# Altium schematic sheet SupplyBox_v3.SchDoc
size C; SheetNumber: 1; SheetTotal: 1
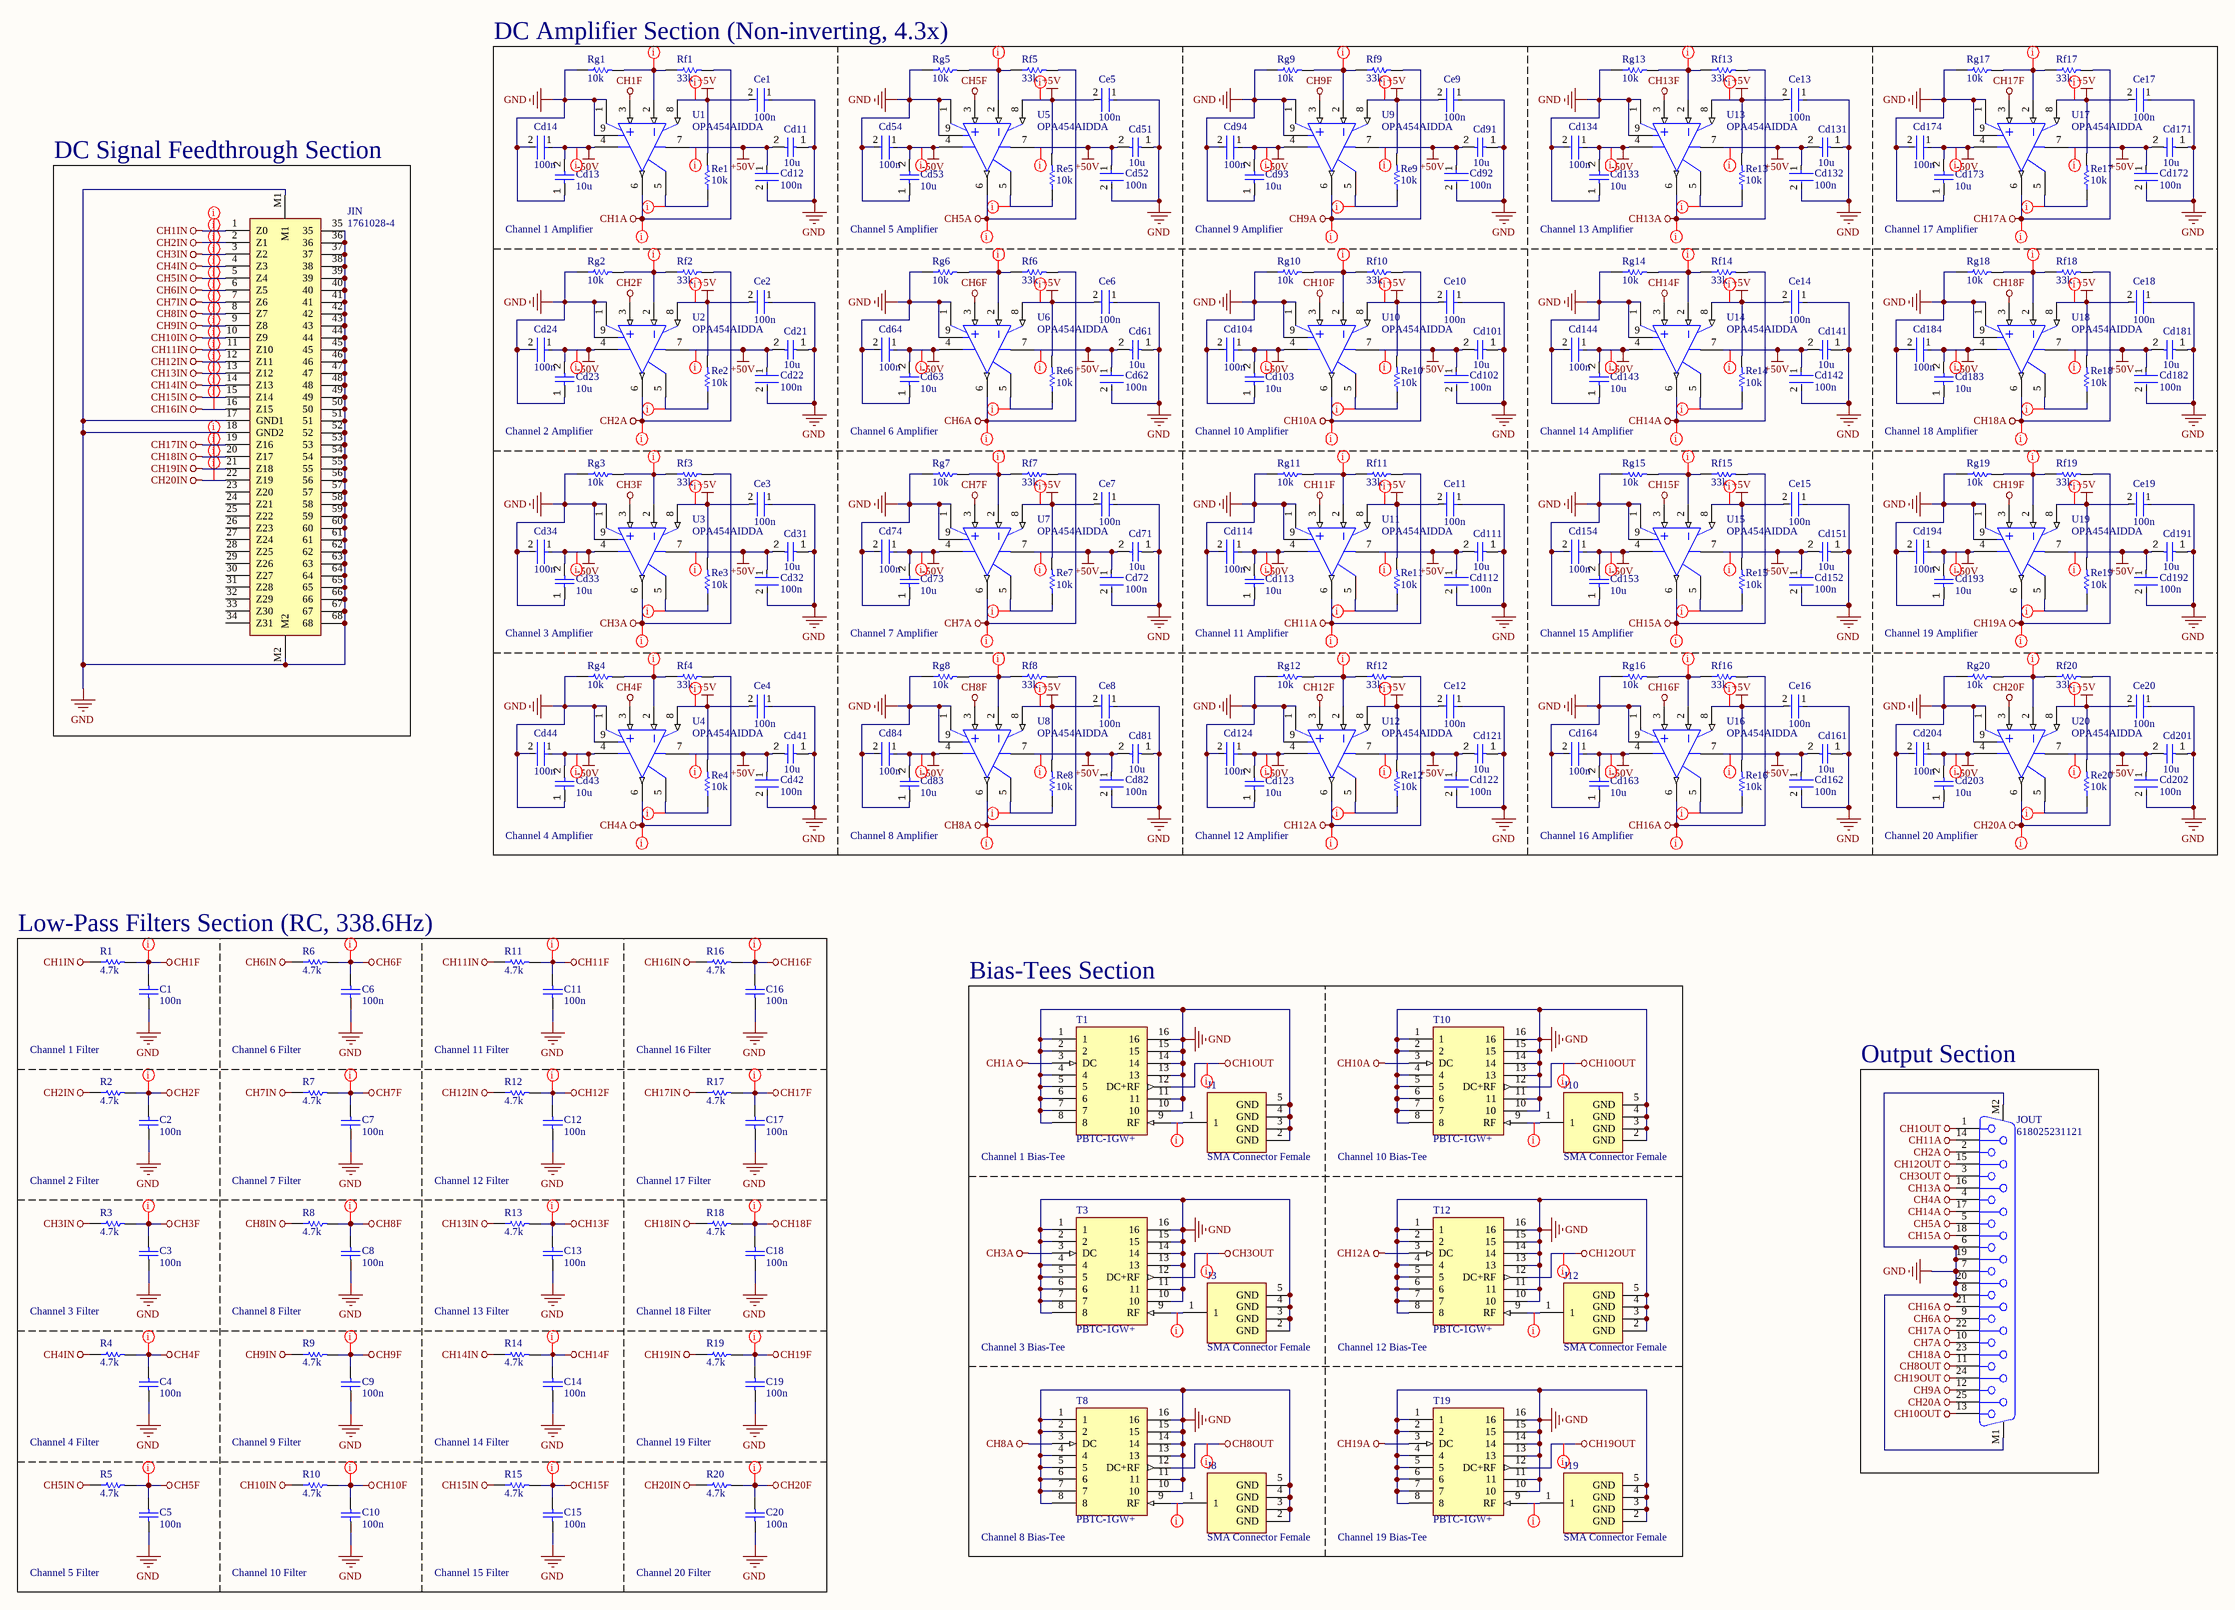
[diagram p0: SupplyBox_v3.SchDoc]

## Parts
C1  100n  [CAPC2013X145X48NL20T23]
C2  100n  [CAPC2013X145X48NL20T23]
C3  100n  [CAPC2013X145X48NL20T23]
C4  100n  [CAPC2013X145X48NL20T23]
C5  100n  [CAPC2013X145X48NL20T23]
C6  100n  [CAPC2013X145X48NL20T23]
C7  100n  [CAPC2013X145X48NL20T23]
C8  100n  [CAPC2013X145X48NL20T23]
C9  100n  [CAPC2013X145X48NL20T23]
C10  100n  [CAPC2013X145X48NL20T23]
C11  100n  [CAPC2013X145X48NL20T23]
C12  100n  [CAPC2013X145X48NL20T23]
C13  100n  [CAPC2013X145X48NL20T23]
C14  100n  [CAPC2013X145X48NL20T23]
C15  100n  [CAPC2013X145X48NL20T23]
C16  100n  [CAPC2013X145X48NL20T23]
C17  100n  [CAPC2013X145X48NL20T23]
C18  100n  [CAPC2013X145X48NL20T23]
C19  100n  [CAPC2013X145X48NL20T23]
C20  100n  [CAPC2013X145X48NL20T23]
Cd11  10u  [RAHV1100M1UCC8002E-Footprint-1]
Cd12  100n  [FP-CC0805-0_85-MFG]
Cd13  10u  [RAHV1100M1UCC8002E-Footprint-1]
Cd14  100n  [FP-CC0805-0_85-MFG]
Cd21  10u  [RAHV1100M1UCC8002E-Footprint-1]
Cd22  100n  [FP-CC0805-0_85-MFG]
Cd23  10u  [RAHV1100M1UCC8002E-Footprint-1]
Cd24  100n  [FP-CC0805-0_85-MFG]
Cd31  10u  [RAHV1100M1UCC8002E-Footprint-1]
Cd32  100n  [FP-CC0805-0_85-MFG]
Cd33  10u  [RAHV1100M1UCC8002E-Footprint-1]
Cd34  100n  [FP-CC0805-0_85-MFG]
Cd41  10u  [RAHV1100M1UCC8002E-Footprint-1]
Cd42  100n  [FP-CC0805-0_85-MFG]
Cd43  10u  [RAHV1100M1UCC8002E-Footprint-1]
Cd44  100n  [FP-CC0805-0_85-MFG]
Cd51  10u  [RAHV1100M1UCC8002E-Footprint-1]
Cd52  100n  [FP-CC0805-0_85-MFG]
Cd53  10u  [RAHV1100M1UCC8002E-Footprint-1]
Cd54  100n  [FP-CC0805-0_85-MFG]
Cd61  10u  [RAHV1100M1UCC8002E-Footprint-1]
Cd62  100n  [FP-CC0805-0_85-MFG]
Cd63  10u  [RAHV1100M1UCC8002E-Footprint-1]
Cd64  100n  [FP-CC0805-0_85-MFG]
Cd71  10u  [RAHV1100M1UCC8002E-Footprint-1]
Cd72  100n  [FP-CC0805-0_85-MFG]
Cd73  10u  [RAHV1100M1UCC8002E-Footprint-1]
Cd74  100n  [FP-CC0805-0_85-MFG]
Cd81  10u  [RAHV1100M1UCC8002E-Footprint-1]
Cd82  100n  [FP-CC0805-0_85-MFG]
Cd83  10u  [RAHV1100M1UCC8002E-Footprint-1]
Cd84  100n  [FP-CC0805-0_85-MFG]
Cd91  10u  [RAHV1100M1UCC8002E-Footprint-1]
Cd92  100n  [FP-CC0805-0_85-MFG]
Cd93  10u  [RAHV1100M1UCC8002E-Footprint-1]
Cd94  100n  [FP-CC0805-0_85-MFG]
Cd101  10u  [RAHV1100M1UCC8002E-Footprint-1]
Cd102  100n  [FP-CC0805-0_85-MFG]
Cd103  10u  [RAHV1100M1UCC8002E-Footprint-1]
Cd104  100n  [FP-CC0805-0_85-MFG]
Cd111  10u  [RAHV1100M1UCC8002E-Footprint-1]
Cd112  100n  [FP-CC0805-0_85-MFG]
Cd113  10u  [RAHV1100M1UCC8002E-Footprint-1]
Cd114  100n  [FP-CC0805-0_85-MFG]
Cd121  10u  [RAHV1100M1UCC8002E-Footprint-1]
Cd122  100n  [FP-CC0805-0_85-MFG]
Cd123  10u  [RAHV1100M1UCC8002E-Footprint-1]
Cd124  100n  [FP-CC0805-0_85-MFG]
Cd131  10u  [RAHV1100M1UCC8002E-Footprint-1]
Cd132  100n  [FP-CC0805-0_85-MFG]
Cd133  10u  [RAHV1100M1UCC8002E-Footprint-1]
Cd134  100n  [FP-CC0805-0_85-MFG]
Cd141  10u  [RAHV1100M1UCC8002E-Footprint-1]
Cd142  100n  [FP-CC0805-0_85-MFG]
Cd143  10u  [RAHV1100M1UCC8002E-Footprint-1]
Cd144  100n  [FP-CC0805-0_85-MFG]
Cd151  10u  [RAHV1100M1UCC8002E-Footprint-1]
Cd152  100n  [FP-CC0805-0_85-MFG]
Cd153  10u  [RAHV1100M1UCC8002E-Footprint-1]
Cd154  100n  [FP-CC0805-0_85-MFG]
Cd161  10u  [RAHV1100M1UCC8002E-Footprint-1]
Cd162  100n  [FP-CC0805-0_85-MFG]
Cd163  10u  [RAHV1100M1UCC8002E-Footprint-1]
Cd164  100n  [FP-CC0805-0_85-MFG]
Cd171  10u  [RAHV1100M1UCC8002E-Footprint-1]
Cd172  100n  [FP-CC0805-0_85-MFG]
Cd173  10u  [RAHV1100M1UCC8002E-Footprint-1]
Cd174  100n  [FP-CC0805-0_85-MFG]
Cd181  10u  [RAHV1100M1UCC8002E-Footprint-1]
Cd182  100n  [FP-CC0805-0_85-MFG]
Cd183  10u  [RAHV1100M1UCC8002E-Footprint-1]
Cd184  100n  [FP-CC0805-0_85-MFG]
Cd191  10u  [RAHV1100M1UCC8002E-Footprint-1]
Cd192  100n  [FP-CC0805-0_85-MFG]
Cd193  10u  [RAHV1100M1UCC8002E-Footprint-1]
Cd194  100n  [FP-CC0805-0_85-MFG]
Cd201  10u  [RAHV1100M1UCC8002E-Footprint-1]
Cd202  100n  [FP-CC0805-0_85-MFG]
Cd203  10u  [RAHV1100M1UCC8002E-Footprint-1]
Cd204  100n  [FP-CC0805-0_85-MFG]
Ce1  100n  [FP-CC0805-0_85-MFG]
Ce2  100n  [FP-CC0805-0_85-MFG]
Ce3  100n  [FP-CC0805-0_85-MFG]
Ce4  100n  [FP-CC0805-0_85-MFG]
Ce5  100n  [FP-CC0805-0_85-MFG]
Ce6  100n  [FP-CC0805-0_85-MFG]
Ce7  100n  [FP-CC0805-0_85-MFG]
Ce8  100n  [FP-CC0805-0_85-MFG]
Ce9  100n  [FP-CC0805-0_85-MFG]
Ce10  100n  [FP-CC0805-0_85-MFG]
Ce11  100n  [FP-CC0805-0_85-MFG]
Ce12  100n  [FP-CC0805-0_85-MFG]
Ce13  100n  [FP-CC0805-0_85-MFG]
Ce14  100n  [FP-CC0805-0_85-MFG]
Ce15  100n  [FP-CC0805-0_85-MFG]
Ce16  100n  [FP-CC0805-0_85-MFG]
Ce17  100n  [FP-CC0805-0_85-MFG]
Ce18  100n  [FP-CC0805-0_85-MFG]
Ce19  100n  [FP-CC0805-0_85-MFG]
Ce20  100n  [FP-CC0805-0_85-MFG]
J1  SMA Connector Female  [SMA_Smaller]
J3  SMA Connector Female  [SMA_Smaller]
J8  SMA Connector Female  [SMA_Smaller]
J10  SMA Connector Female  [SMA_Smaller]
J12  SMA Connector Female  [SMA_Smaller]
J19  SMA Connector Female  [SMA_Smaller]
JIN  1761028-4  [1761028-4-Footprint-1]
JOUT  618025231121  [618025231121]
R1  4.7k  [RESC2013X60X35NL10T20]
R2  4.7k  [RESC2013X60X35NL10T20]
R3  4.7k  [RESC2013X60X35NL10T20]
R4  4.7k  [RESC2013X60X35NL10T20]
R5  4.7k  [RESC2013X60X35NL10T20]
R6  4.7k  [RESC2013X60X35NL10T20]
R7  4.7k  [RESC2013X60X35NL10T20]
R8  4.7k  [RESC2013X60X35NL10T20]
R9  4.7k  [RESC2013X60X35NL10T20]
R10  4.7k  [RESC2013X60X35NL10T20]
R11  4.7k  [RESC2013X60X35NL10T20]
R12  4.7k  [RESC2013X60X35NL10T20]
R13  4.7k  [RESC2013X60X35NL10T20]
R14  4.7k  [RESC2013X60X35NL10T20]
R15  4.7k  [RESC2013X60X35NL10T20]
R16  4.7k  [RESC2013X60X35NL10T20]
R17  4.7k  [RESC2013X60X35NL10T20]
R18  4.7k  [RESC2013X60X35NL10T20]
R19  4.7k  [RESC2013X60X35NL10T20]
R20  4.7k  [RESC2013X60X35NL10T20]
Re1  10k  [RESC2013X60X35ML10T20]
Re2  10k  [RESC2013X60X35ML10T20]
Re3  10k  [RESC2013X60X35ML10T20]
Re4  10k  [RESC2013X60X35ML10T20]
Re5  10k  [RESC2013X60X35ML10T20]
Re6  10k  [RESC2013X60X35ML10T20]
Re7  10k  [RESC2013X60X35ML10T20]
Re8  10k  [RESC2013X60X35ML10T20]
Re9  10k  [RESC2013X60X35ML10T20]
Re10  10k  [RESC2013X60X35ML10T20]
Re11  10k  [RESC2013X60X35ML10T20]
Re12  10k  [RESC2013X60X35ML10T20]
Re13  10k  [RESC2013X60X35ML10T20]
Re14  10k  [RESC2013X60X35ML10T20]
Re15  10k  [RESC2013X60X35ML10T20]
Re16  10k  [RESC2013X60X35ML10T20]
Re17  10k  [RESC2013X60X35ML10T20]
Re18  10k  [RESC2013X60X35ML10T20]
Re19  10k  [RESC2013X60X35ML10T20]
Re20  10k  [RESC2013X60X35ML10T20]
Rf1  33k  [RESC2013X60X35ML10T20]
Rf2  33k  [RESC2013X60X35ML10T20]
Rf3  33k  [RESC2013X60X35ML10T20]
Rf4  33k  [RESC2013X60X35ML10T20]
Rf5  33k  [RESC2013X60X35ML10T20]
Rf6  33k  [RESC2013X60X35ML10T20]
Rf7  33k  [RESC2013X60X35ML10T20]
Rf8  33k  [RESC2013X60X35ML10T20]
Rf9  33k  [RESC2013X60X35ML10T20]
Rf10  33k  [RESC2013X60X35ML10T20]
Rf11  33k  [RESC2013X60X35ML10T20]
Rf12  33k  [RESC2013X60X35ML10T20]
Rf13  33k  [RESC2013X60X35ML10T20]
Rf14  33k  [RESC2013X60X35ML10T20]
Rf15  33k  [RESC2013X60X35ML10T20]
Rf16  33k  [RESC2013X60X35ML10T20]
Rf17  33k  [RESC2013X60X35ML10T20]
Rf18  33k  [RESC2013X60X35ML10T20]
Rf19  33k  [RESC2013X60X35ML10T20]
Rf20  33k  [RESC2013X60X35ML10T20]
Rg1  10k  [RESC2013X60X35ML10T20]
Rg2  10k  [RESC2013X60X35ML10T20]
Rg3  10k  [RESC2013X60X35ML10T20]
Rg4  10k  [RESC2013X60X35ML10T20]
Rg5  10k  [RESC2013X60X35ML10T20]
Rg6  10k  [RESC2013X60X35ML10T20]
Rg7  10k  [RESC2013X60X35ML10T20]
Rg8  10k  [RESC2013X60X35ML10T20]
Rg9  10k  [RESC2013X60X35ML10T20]
Rg10  10k  [RESC2013X60X35ML10T20]
Rg11  10k  [RESC2013X60X35ML10T20]
Rg12  10k  [RESC2013X60X35ML10T20]
Rg13  10k  [RESC2013X60X35ML10T20]
Rg14  10k  [RESC2013X60X35ML10T20]
Rg15  10k  [RESC2013X60X35ML10T20]
Rg16  10k  [RESC2013X60X35ML10T20]
Rg17  10k  [RESC2013X60X35ML10T20]
Rg18  10k  [RESC2013X60X35ML10T20]
Rg19  10k  [RESC2013X60X35ML10T20]
Rg20  10k  [RESC2013X60X35ML10T20]
T1  PBTC-1GW+  [PBTC-1GW+]
T3  PBTC-1GW+  [PBTC-1GW+]
T8  PBTC-1GW+  [PBTC-1GW+]
T10  PBTC-1GW+  [PBTC-1GW+]
T12  PBTC-1GW+  [PBTC-1GW+]
T19  PBTC-1GW+  [PBTC-1GW+]
U1  OPA454AIDDA  [DDA0008C_L]
U2  OPA454AIDDA  [DDA0008C_L]
U3  OPA454AIDDA  [DDA0008C_L]
U4  OPA454AIDDA  [DDA0008C_L]
U5  OPA454AIDDA  [DDA0008C_L]
U6  OPA454AIDDA  [DDA0008C_L]
U7  OPA454AIDDA  [DDA0008C_L]
U8  OPA454AIDDA  [DDA0008C_L]
U9  OPA454AIDDA  [DDA0008C_L]
U10  OPA454AIDDA  [DDA0008C_L]
U11  OPA454AIDDA  [DDA0008C_L]
U12  OPA454AIDDA  [DDA0008C_L]
U13  OPA454AIDDA  [DDA0008C_L]
U14  OPA454AIDDA  [DDA0008C_L]
U15  OPA454AIDDA  [DDA0008C_L]
U16  OPA454AIDDA  [DDA0008C_L]
U17  OPA454AIDDA  [DDA0008C_L]
U18  OPA454AIDDA  [DDA0008C_L]
U19  OPA454AIDDA  [DDA0008C_L]
U20  OPA454AIDDA  [DDA0008C_L]

## Blocks framed on the sheet
DC Amplifier Section (Non-inverting, 4.3x): Cd11-Cd14 Cd21-Cd24 Cd31-Cd34 Cd41-Cd44 Cd51-Cd54 Cd61-Cd64 Cd71-Cd74 Cd81-Cd84 Cd91-Cd94 Cd101-Cd104 Cd111-Cd114 Cd121-Cd124 Cd131-Cd134 Cd141-Cd144 Cd151-Cd154 Cd161-Cd164 Cd171-Cd174 Cd181-Cd184 Cd191-Cd194 Cd201-Cd204 Ce1-Ce20 Re1-Re20 Rf1-Rf20 Rg1-Rg20 U1-U20
DC Signal Feedthrough Section: JIN
Low-Pass Filters Section (RC, 338.6Hz): C1-C20 R1-R20
Bias-Tees Section: J1 J3 J8 J10 J12 J19 T1 T3 T8 T10 T12 T19
Output Section: JOUT

## Nets
+5V: Ce1.2 Ce2.2 Ce3.2 Ce4.2 Ce5.2 Ce6.2 Ce7.2 Ce8.2 Ce9.2 Ce10.2 Ce11.2 Ce12.2 Ce13.2 Ce14.2 Ce15.2 Ce16.2 Ce17.2 Ce18.2 Ce19.2 Ce20.2 Re1.2 Re2.2 Re3.2 Re4.2 Re5.2 Re6.2 Re7.2 Re8.2 Re9.2 Re10.2 Re11.2 Re12.2 Re13.2 Re14.2 Re15.2 Re16.2 Re17.2 Re18.2 Re19.2 Re20.2 U1.8(E/D) U2.8(E/D) U3.8(E/D) U4.8(E/D) U5.8(E/D) U6.8(E/D) U7.8(E/D) U8.8(E/D) U9.8(E/D) U10.8(E/D) U11.8(E/D) U12.8(E/D) U13.8(E/D) U14.8(E/D) U15.8(E/D) U16.8(E/D) U17.8(E/D) U18.8(E/D) U19.8(E/D) U20.8(E/D)
+50V: Cd11.2 Cd12.1 Cd21.2 Cd22.1 Cd31.2 Cd32.1 Cd41.2 Cd42.1 Cd51.2 Cd52.1 Cd61.2 Cd62.1 Cd71.2 Cd72.1 Cd81.2 Cd82.1 Cd91.2 Cd92.1 Cd101.2 Cd102.1 Cd111.2 Cd112.1 Cd121.2 Cd122.1 Cd131.2 Cd132.1 Cd141.2 Cd142.1 Cd151.2 Cd152.1 Cd161.2 Cd162.1 Cd171.2 Cd172.1 Cd181.2 Cd182.1 Cd191.2 Cd192.1 Cd201.2 Cd202.1 U1.7(V+) U2.7(V+) U3.7(V+) U4.7(V+) U5.7(V+) U6.7(V+) U7.7(V+) U8.7(V+) U9.7(V+) U10.7(V+) U11.7(V+) U12.7(V+) U13.7(V+) U14.7(V+) U15.7(V+) U16.7(V+) U17.7(V+) U18.7(V+) U19.7(V+) U20.7(V+)
-50V: Cd13.2 Cd14.1 Cd23.2 Cd24.1 Cd33.2 Cd34.1 Cd43.2 Cd44.1 Cd53.2 Cd54.1 Cd63.2 Cd64.1 Cd73.2 Cd74.1 Cd83.2 Cd84.1 Cd93.2 Cd94.1 Cd103.2 Cd104.1 Cd113.2 Cd114.1 Cd123.2 Cd124.1 Cd133.2 Cd134.1 Cd143.2 Cd144.1 Cd153.2 Cd154.1 Cd163.2 Cd164.1 Cd173.2 Cd174.1 Cd183.2 Cd184.1 Cd193.2 Cd194.1 Cd203.2 Cd204.1 U1.4(V-) U2.4(V-) U3.4(V-) U4.4(V-) U5.4(V-) U6.4(V-) U7.4(V-) U8.4(V-) U9.4(V-) U10.4(V-) U11.4(V-) U12.4(V-) U13.4(V-) U14.4(V-) U15.4(V-) U16.4(V-) U17.4(V-) U18.4(V-) U19.4(V-) U20.4(V-)
CH1A: Rf1.2 T1.3(DC) U1.6(OUT)
CH1F: C1.2 R1.2 U1.3(IN+)
CH1IN: JIN.1(Z0) R1.1
CH1OUT: JOUT.1 T1.12(DC+RF)
CH2A: JOUT.2 Rf2.2 U2.6(OUT)
CH2F: C2.2 R2.2 U2.3(IN+)
CH2IN: JIN.2(Z1) R2.1
CH3A: Rf3.2 T3.3(DC) U3.6(OUT)
CH3F: C3.2 R3.2 U3.3(IN+)
CH3IN: JIN.3(Z2) R3.1
CH3OUT: JOUT.3 T3.12(DC+RF)
CH4A: JOUT.4 Rf4.2 U4.6(OUT)
CH4F: C4.2 R4.2 U4.3(IN+)
CH4IN: JIN.4(Z3) R4.1
CH5A: JOUT.5 Rf5.2 U5.6(OUT)
CH5F: C5.2 R5.2 U5.3(IN+)
CH5IN: JIN.5(Z4) R5.1
CH6A: JOUT.9 Rf6.2 U6.6(OUT)
CH6F: C6.2 R6.2 U6.3(IN+)
CH6IN: JIN.6(Z5) R6.1
CH7A: JOUT.10 Rf7.2 U7.6(OUT)
CH7F: C7.2 R7.2 U7.3(IN+)
CH7IN: JIN.7(Z6) R7.1
CH8A: Rf8.2 T8.3(DC) U8.6(OUT)
CH8F: C8.2 R8.2 U8.3(IN+)
CH8IN: JIN.8(Z7) R8.1
CH8OUT: JOUT.11 T8.12(DC+RF)
CH9A: JOUT.12 Rf9.2 U9.6(OUT)
CH9F: C9.2 R9.2 U9.3(IN+)
CH9IN: JIN.9(Z8) R9.1
CH10A: Rf10.2 T10.3(DC) U10.6(OUT)
CH10F: C10.2 R10.2 U10.3(IN+)
CH10IN: JIN.10(Z9) R10.1
CH10OUT: JOUT.13 T10.12(DC+RF)
CH11A: JOUT.14 Rf11.2 U11.6(OUT)
CH11F: C11.2 R11.2 U11.3(IN+)
CH11IN: JIN.11(Z10) R11.1
CH12A: Rf12.2 T12.3(DC) U12.6(OUT)
CH12F: C12.2 R12.2 U12.3(IN+)
CH12IN: JIN.12(Z11) R12.1
CH12OUT: JOUT.15 T12.12(DC+RF)
CH13A: JOUT.16 Rf13.2 U13.6(OUT)
CH13F: C13.2 R13.2 U13.3(IN+)
CH13IN: JIN.13(Z12) R13.1
CH14A: JOUT.17 Rf14.2 U14.6(OUT)
CH14F: C14.2 R14.2 U14.3(IN+)
CH14IN: JIN.14(Z13) R14.1
CH15A: JOUT.18 Rf15.2 U15.6(OUT)
CH15F: C15.2 R15.2 U15.3(IN+)
CH15IN: JIN.15(Z14) R15.1
CH16A: JOUT.21 Rf16.2 U16.6(OUT)
CH16F: C16.2 R16.2 U16.3(IN+)
CH16IN: JIN.16(Z15) R16.1
CH17A: JOUT.22 Rf17.2 U17.6(OUT)
CH17F: C17.2 R17.2 U17.3(IN+)
CH17IN: JIN.19(Z16) R17.1
CH18A: JOUT.23 Rf18.2 U18.6(OUT)
CH18F: C18.2 R18.2 U18.3(IN+)
CH18IN: JIN.20(Z17) R18.1
CH19A: Rf19.2 T19.3(DC) U19.6(OUT)
CH19F: C19.2 R19.2 U19.3(IN+)
CH19IN: JIN.21(Z18) R19.1
CH19OUT: JOUT.24 T19.12(DC+RF)
CH20A: JOUT.25 Rf20.2 U20.6(OUT)
CH20F: C20.2 R20.2 U20.3(IN+)
CH20IN: JIN.22(Z19) R20.1
GND: C1.1 C2.1 C3.1 C4.1 C5.1 C6.1 C7.1 C8.1 C9.1 C10.1 C11.1 C12.1 C13.1 C14.1 C15.1 C16.1 C17.1 C18.1 C19.1 C20.1 Cd11.1 Cd12.2 Cd13.1 Cd14.2 Cd21.1 Cd22.2 Cd23.1 Cd24.2 Cd31.1 Cd32.2 Cd33.1 Cd34.2 Cd41.1 Cd42.2 Cd43.1 Cd44.2 Cd51.1 Cd52.2 Cd53.1 Cd54.2 Cd61.1 Cd62.2 Cd63.1 Cd64.2 Cd71.1 Cd72.2 Cd73.1 Cd74.2 Cd81.1 Cd82.2 Cd83.1 Cd84.2 Cd91.1 Cd92.2 Cd93.1 Cd94.2 Cd101.1 Cd102.2 Cd103.1 Cd104.2 Cd111.1 Cd112.2 Cd113.1 Cd114.2 Cd121.1 Cd122.2 Cd123.1 Cd124.2 Cd131.1 Cd132.2 Cd133.1 Cd134.2 Cd141.1 Cd142.2 Cd143.1 Cd144.2 Cd151.1 Cd152.2 Cd153.1 Cd154.2 Cd161.1 Cd162.2 Cd163.1 Cd164.2 Cd171.1 Cd172.2 Cd173.1 Cd174.2 Cd181.1 Cd182.2 Cd183.1 Cd184.2 Cd191.1 Cd192.2 Cd193.1 Cd194.2 Cd201.1 Cd202.2 Cd203.1 Cd204.2 Ce1.1 Ce2.1 Ce3.1 Ce4.1 Ce5.1 Ce6.1 Ce7.1 Ce8.1 Ce9.1 Ce10.1 Ce11.1 Ce12.1 Ce13.1 Ce14.1 Ce15.1 Ce16.1 Ce17.1 Ce18.1 Ce19.1 Ce20.1 J1.2(GND) J1.3(GND) J1.4(GND) J1.5(GND) J3.2(GND) J3.3(GND) J3.4(GND) J3.5(GND) J8.2(GND) J8.3(GND) J8.4(GND) J8.5(GND) J10.2(GND) J10.3(GND) J10.4(GND) J10.5(GND) J12.2(GND) J12.3(GND) J12.4(GND) J12.5(GND) J19.2(GND) J19.3(GND) J19.4(GND) J19.5(GND) JIN.17(GND1) JIN.18(GND2) JIN.35 JIN.36 JIN.37 JIN.38 JIN.39 JIN.40 JIN.41 JIN.42 JIN.43 JIN.44 JIN.45 JIN.46 JIN.47 JIN.48 JIN.49 JIN.50 JIN.51 JIN.52 JIN.53 JIN.54 JIN.55 JIN.56 JIN.57 JIN.58 JIN.59 JIN.60 JIN.61 JIN.62 JIN.63 JIN.64 JIN.65 JIN.66 JIN.67 JIN.68 JIN.M1 JIN.M2 JOUT.6 JOUT.7 JOUT.8 JOUT.19 JOUT.20 JOUT.M1 JOUT.M2 Rg1.1 Rg2.1 Rg3.1 Rg4.1 Rg5.1 Rg6.1 Rg7.1 Rg8.1 Rg9.1 Rg10.1 Rg11.1 Rg12.1 Rg13.1 Rg14.1 Rg15.1 Rg16.1 Rg17.1 Rg18.1 Rg19.1 Rg20.1 T1.1 T1.2 T1.4 T1.5 T1.6 T1.7 T1.8 T1.10 T1.11 T1.13 T1.14 T1.15 T1.16 T3.1 T3.2 T3.4 T3.5 T3.6 T3.7 T3.8 T3.10 T3.11 T3.13 T3.14 T3.15 T3.16 T8.1 T8.2 T8.4 T8.5 T8.6 T8.7 T8.8 T8.10 T8.11 T8.13 T8.14 T8.15 T8.16 T10.1 T10.2 T10.4 T10.5 T10.6 T10.7 T10.8 T10.10 T10.11 T10.13 T10.14 T10.15 T10.16 T12.1 T12.2 T12.4 T12.5 T12.6 T12.7 T12.8 T12.10 T12.11 T12.13 T12.14 T12.15 T12.16 T19.1 T19.2 T19.4 T19.5 T19.6 T19.7 T19.8 T19.10 T19.11 T19.13 T19.14 T19.15 T19.16 U1.1(E/D_COM) U1.9(EP) U2.1(E/D_COM) U2.9(EP) U3.1(E/D_COM) U3.9(EP) U4.1(E/D_COM) U4.9(EP) U5.1(E/D_COM) U5.9(EP) U6.1(E/D_COM) U6.9(EP) U7.1(E/D_COM) U7.9(EP) U8.1(E/D_COM) U8.9(EP) U9.1(E/D_COM) U9.9(EP) U10.1(E/D_COM) U10.9(EP) U11.1(E/D_COM) U11.9(EP) U12.1(E/D_COM) U12.9(EP) U13.1(E/D_COM) U13.9(EP) U14.1(E/D_COM) U14.9(EP) U15.1(E/D_COM) U15.9(EP) U16.1(E/D_COM) U16.9(EP) U17.1(E/D_COM) U17.9(EP) U18.1(E/D_COM) U18.9(EP) U19.1(E/D_COM) U19.9(EP) U20.1(E/D_COM) U20.9(EP)
NetJ1_1: J1.1 T1.9(RF)
NetJ3_1: J3.1 T3.9(RF)
NetJ8_1: J8.1 T8.9(RF)
NetJ10_1: J10.1 T10.9(RF)
NetJ12_1: J12.1 T12.9(RF)
NetJ19_1: J19.1 T19.9(RF)
NetRe1_1: Re1.1 U1.5(STATUS_FLAG)
NetRe2_1: Re2.1 U2.5(STATUS_FLAG)
NetRe3_1: Re3.1 U3.5(STATUS_FLAG)
NetRe4_1: Re4.1 U4.5(STATUS_FLAG)
NetRe5_1: Re5.1 U5.5(STATUS_FLAG)
NetRe6_1: Re6.1 U6.5(STATUS_FLAG)
NetRe7_1: Re7.1 U7.5(STATUS_FLAG)
NetRe8_1: Re8.1 U8.5(STATUS_FLAG)
NetRe9_1: Re9.1 U9.5(STATUS_FLAG)
NetRe10_1: Re10.1 U10.5(STATUS_FLAG)
NetRe11_1: Re11.1 U11.5(STATUS_FLAG)
NetRe12_1: Re12.1 U12.5(STATUS_FLAG)
NetRe13_1: Re13.1 U13.5(STATUS_FLAG)
NetRe14_1: Re14.1 U14.5(STATUS_FLAG)
NetRe15_1: Re15.1 U15.5(STATUS_FLAG)
NetRe16_1: Re16.1 U16.5(STATUS_FLAG)
NetRe17_1: Re17.1 U17.5(STATUS_FLAG)
NetRe18_1: Re18.1 U18.5(STATUS_FLAG)
NetRe19_1: Re19.1 U19.5(STATUS_FLAG)
NetRe20_1: Re20.1 U20.5(STATUS_FLAG)
NetRf1_1: Rf1.1 Rg1.2 U1.2(IN-)
NetRf2_1: Rf2.1 Rg2.2 U2.2(IN-)
NetRf3_1: Rf3.1 Rg3.2 U3.2(IN-)
NetRf4_1: Rf4.1 Rg4.2 U4.2(IN-)
NetRf5_1: Rf5.1 Rg5.2 U5.2(IN-)
NetRf6_1: Rf6.1 Rg6.2 U6.2(IN-)
NetRf7_1: Rf7.1 Rg7.2 U7.2(IN-)
NetRf8_1: Rf8.1 Rg8.2 U8.2(IN-)
NetRf9_1: Rf9.1 Rg9.2 U9.2(IN-)
NetRf10_1: Rf10.1 Rg10.2 U10.2(IN-)
NetRf11_1: Rf11.1 Rg11.2 U11.2(IN-)
NetRf12_1: Rf12.1 Rg12.2 U12.2(IN-)
NetRf13_1: Rf13.1 Rg13.2 U13.2(IN-)
NetRf14_1: Rf14.1 Rg14.2 U14.2(IN-)
NetRf15_1: Rf15.1 Rg15.2 U15.2(IN-)
NetRf16_1: Rf16.1 Rg16.2 U16.2(IN-)
NetRf17_1: Rf17.1 Rg17.2 U17.2(IN-)
NetRf18_1: Rf18.1 Rg18.2 U18.2(IN-)
NetRf19_1: Rf19.1 Rg19.2 U19.2(IN-)
NetRf20_1: Rf20.1 Rg20.2 U20.2(IN-)

Not connected (* = marked no-connect by the designer): JIN 23(Z20) 24(Z21) 25(Z22) 26(Z23) 27(Z24) 28(Z25) 29(Z26) 30(Z27) 31(Z28) 32(Z29) 33(Z30) 34(Z31)

## Layout directives
net class HV: +50V, -50V, CH1A, CH2A, CH3A, CH4A, CH5A, CH6A, CH7A, CH8A, CH9A, CH10A, CH11A, CH12A, CH13A, CH14A, CH15A, CH16A, CH17A, CH18A, CH19A, CH20A
net class LV: +5V, CH1F, CH1IN, CH2F, CH2IN, CH3F, CH3IN, CH4F, CH4IN, CH5F, CH5IN, CH6F, CH6IN, CH7F, CH7IN, CH8F, CH8IN, CH9F, CH9IN, CH10F, CH10IN, CH11F, CH11IN, CH12F, CH12IN, CH13F, CH13IN, CH14F, CH14IN, CH15F, CH15IN, CH16F, CH16IN, CH17F, CH17IN, CH18F, CH18IN, CH19F, CH19IN, CH20F, CH20IN, NetRe1_1, NetRe2_1, NetRe3_1, NetRe4_1, NetRe5_1, NetRe6_1, NetRe7_1, NetRe8_1, NetRe9_1, NetRe10_1, NetRe11_1, NetRe12_1, NetRe13_1, NetRe14_1, NetRe15_1, NetRe16_1, NetRe17_1, NetRe18_1, NetRe19_1, NetRe20_1, NetRf1_1, NetRf2_1, NetRf3_1, NetRf4_1, NetRf5_1, NetRf6_1, NetRf7_1, NetRf8_1, NetRf9_1, NetRf10_1, NetRf11_1, NetRf12_1, NetRf13_1, NetRf14_1, NetRf15_1, NetRf16_1, NetRf17_1, NetRf18_1, NetRf19_1, NetRf20_1
net class RF: CH1OUT, CH3OUT, CH8OUT, CH10OUT, CH12OUT, CH19OUT, NetJ1_1, NetJ3_1, NetJ8_1, NetJ10_1, NetJ12_1, NetJ19_1

## Notes on the sheet
- Channel 1 Amplifier
- Channel 5 Amplifier
- Channel 9 Amplifier
- Channel 13 Amplifier
- Channel 17 Amplifier
- Channel 2 Amplifier
- Channel 6 Amplifier
- Channel 10 Amplifier
- Channel 14 Amplifier
- Channel 18 Amplifier
- Channel 3 Amplifier
- Channel 7 Amplifier
- Channel 11 Amplifier
- Channel 15 Amplifier
- Channel 19 Amplifier
- Channel 4 Amplifier
- Channel 8 Amplifier
- Channel 12 Amplifier
- Channel 16 Amplifier
- Channel 20 Amplifier
- (near R2) Channel 1 Filter
- (near R7) Channel 6 Filter
- Channel 11 Filter
- Channel 16 Filter
- (near R3) Channel 2 Filter
- (near R8) Channel 7 Filter
- Channel 12 Filter
- Channel 17 Filter
- (near T1) Channel 1 Bias-Tee
- (near T10) Channel 10 Bias-Tee
- (near R4) Channel 3 Filter
- (near R9) Channel 8 Filter
- Channel 13 Filter
- Channel 18 Filter
- (near T3) Channel 3 Bias-Tee
- (near T12) Channel 12 Bias-Tee
- (near R5) Channel 4 Filter
- (near R10) Channel 9 Filter
- Channel 14 Filter
- Channel 19 Filter
- (near T8) Channel 8 Bias-Tee
- (near T19) Channel 19 Bias-Tee
- Channel 5 Filter
- Channel 10 Filter
- Channel 15 Filter
- Channel 20 Filter

## Library data of the parts
C1-C20 = CMP-2007-03167-1: Manufacturer: Vitramon; Part Number: VJ0805Y104KNAAT
Cd11 Cd13 Cd21 Cd23 Cd31 Cd33 Cd41 Cd43 Cd51 Cd53 Cd61 Cd63 Cd71 Cd73 Cd81 Cd83 Cd91 Cd93 Cd101 Cd103 Cd111 Cd113 Cd121 Cd123 Cd131 Cd133 Cd141 Cd143 Cd151 Cd153 Cd161 Cd163 Cd171 Cd173 Cd181 Cd183 Cd191 Cd193 Cd201 Cd203 = CMP-001-00083-1: Aluminum Electrolytic Capacitor, Polarized, Aluminum (solid Polymer), 50V, 20% +Tol, 20% -Tol, 10uF, Surface Mount, 2121; RoHS Compliant: Yes
Cd12 Cd14 Cd22 Cd24 Cd32 Cd34 Cd42 Cd44 Cd52 Cd54 Cd62 Cd64 Cd72 Cd74 Cd82 Cd84 Cd92 Cd94 Cd102 Cd104 Cd112 Cd114 Cd122 Cd124 Cd132 Cd134 Cd142 Cd144 Cd152 Cd154 Cd162 Cd164 Cd172 Cd174 Cd182 Cd184 Cd192 Cd194 Cd202 Cd204 Ce1-Ce20 = CMP-1036-04410-2: CAP CER 0.1UF 25V X7R 0805; Manufacturer Part Number: CC0805KRX7R8BB104; Manufacturer: Yageo; Tolerance: 0.1; Value: 100 nF; ComponentLink2URL: http://www.yageo.com/documents/recent/UPY-GPHC_Y5V_6.3V-to-50V_8.pdf; Category: Cap; Mouser Description: Multilayer Ceramic Capacitors MLCC - SMD/SMT 100nF 25V X7R 10%; Device Class L1: Passive Components; Footprint Url: http://www.yageo.com/exep/pages/download/literatures/UPY-C_GEN_24.pdf; Height: 0.95mm; Material: Ceramic; Digikey Description: CAP CER 0.1UF 25V X7R 0805; Lead Free: Yes; Temperature Range High: +85°C; Temperature: -30°C to +85°C; Ipc Land Pattern Name: CAPC200125X85; Capacitance: 100 nF; Automotive: No; Octopart: https://octopart.com/cc0805krx7r8bb104-yageo-39467766; Device Class L2: Capacitors; Temperature Characteristic: X7R; Voltage Rating: 25 V; ComponentLink2Description: Datasheet; Temperature Range Low: -30°C; Device Class L3: Ceramic Capacitors; RoHS: TRUE; Package: CC0805-0.85
J1 J3 J8 J10 J12 J19 = CMP-002-00072-1: Our smaller SMA Female Connector purchased from amazon.com
JIN = CMP-002-00071-1: Telecom and Datacom Connector, 68 Contact(s), Female, Right Angle, Solder Terminal, #2-56, Receptacle; Connector Type: TELECOM AND DATACOM CONNECTOR; Mounting Technology: Panel,Board; Max Operating Temperature: 105°C; Min Operating Temperature: -55°C; RoHS Compliant: Yes
JOUT = CMP-1502-00202-2: NexarPartId: 18818207; Pitch: 2.77mm; Operating Supply Voltage: 125V; Gender: Female; Insulation Resistance: 5GΩ; Contact Resistance: 30mΩ; Current Rating: 3A; Number of Contacts: 25; Contact Plating: Gold; Width: 12.5mm; RoHS: Compliant; REACH SVHC: Unknown; Min Operating Temperature: -55°C; Termination: SMD/SMT; Voltage Rating: 125V; Mount: Through Hole; Housing Material: Steel; Insulation Material: PBT; Number of Rows: 2; Depth: 18.5mm; Orientation: Right Angle; Number of Pins: 25; Max Operating Temperature: 105°C; Length: 38.33mm
R1-R20 = CMP-1659-00011-4: Chip Resistor, 47 KOhm, +/- 1%, 0.125 W, -55 to 155 degC, 0805 (2012 Metric), RoHS, Tape and Reel; Manufacturer: Yageo; Voltage Rating: 150 V; Height: 0.5 mm; ComponentLink2URL: http://www.yageo.com/documents/recent/PYu-RC_Group_51_RoHS_L_04.pdf; ComponentLink2Description: Datasheet; Package Quantity: 200; Max Operating Temperature: 155 degC; Min Operating Temperature: -55 degC; Packaging: Tape and Reel; Pins: 2; PackageReference: 0805; Mounting Technology: Surface Mount; ComponentLink1Description: Manufacturer URL; ComponentLink1URL: http://www.yageo.com/; PackageDescription: 2-Pin Surface Mounted Device, Body 2 x 1.25 mm; Length: 2 mm; REACH SVHC: No SVHC; Mount: Surface Mount; RoHSCompliant: true; DatasheetVersion: Rev. 4, 02/2016
Re1-Re20 Rg1-Rg20 = CMP-2100-03671-1: Chip Resistor, 1 KOhm, +/- 1%, 125 mW, -55 to 155 degC, 0805 (2012 Metric), RoHS, Tape and Reel; Manufacturer: Yageo; Temperature Coefficient: 100ppm/degreesC; Voltage Rating (DC): 150V; Max Power Dissipation: 125mW; Resistance: 1KOhm; Number of Pins: 2; Number of Terminations: 2; Datasheet URL: http://www.yageo.com/NewPortal/yageodocoutput?fileName=/pdf/R-Chip/PYu-RC_Group_51_RoHS_L_5.pdf; Length: 0.079inch; Package Description: 2-Pin Surface Mounted Device, Body 2 x 1.25 mm; Depth: 1.25mm; Height: 0.024inch; Military Standard: Not; Case/Package: 0805; Package Reference: 0805; RoHSCompliant: true; Lead Free: LeadFree; Packaging: TapeandReel; Package Quantity: 1; Datasheet Version: Rev. 5, 10/2016; Tolerance: 1%; Min Operating Temperature: -55degC; Voltage Rating: 150V; Composition: ThickFilm; Case Code (Imperial): 0805; Power Rating: 125mW; Width: 0.049inch; Case Code (Metric): 2012; Manufacturer URL: http://www.yageo.com/; Max Operating Temperature: 155degC; REACH SVHC: Unknown; Termination: SMD/SMT
Rf1-Rf20 = CMP-1013-00567-2: Chip Resistor, 3.3 KOhm, +/- 1%, 0.125 W, -55 to 155 degC, 0805 (2012 Metric), RoHS, Tape and Reel; Manufacturer: Yageo; Voltage Rating: 150V; Max Power Dissipation: 125mW; Temperature Coefficient: 100ppm/degreesC; Package Quantity: 1; Max Operating Temperature: 155degC; Case Code (Metric): 2012; Package Reference: 0805; Resistance: 3.3KOhm; Composition: ThickFilm; RoHSCompliant: true; Case/Package: 0805; Case Code (Imperial): 0805; Tolerance: 1%; Depth: 1.25mm; Weight: 0.000194oz; Lead Free: LeadFree; Min Operating Temperature: -55degC; Termination: SMD/SMT; Datasheet Version: Rev. 5, 10/2016; REACH SVHC: NoSVHC; Power Rating: 125mW; Packaging: TapeandReel; Number of Terminations: 2; Width: 0.049inch; Package Description: 2-Pin Surface Mounted Device, Body 2 x 1.25 mm; Datasheet URL: http://www.yageo.com/NewPortal/yageodocoutput?fileName=/pdf/R-Chip/PYu-RC_Group_51_RoHS_L_5.pdf; Height: 0.5mm; Length: 2mm; Manufacturer URL: http://www.yageo.com/
T1 T3 T8 T10 T12 T19 = CMP-00025-00004-1: Mini-Circuit Bias-Tee (Version 2)
U1-U20 = CMP-0017-00714-2: High Voltage (100V), High-Current (50mA) Operational Amplifier, G=1 Stable, 10 to 100 V, -55 to 125 degC, 8-pin SOP (DDA8), Green (RoHS & no Sb/Br); Manufacturer: Texas Instruments; Number of Channels: 1; CMRR(Min)(dB): 100; Rating: Catalog; Total Supply Voltage(Min)(+5V is 5, +/-5V is 10): 10; Offset Drift(Typ)(uV/C): 1.6; Vn at 1kHz(Typ)(nV/rtHz): 47; Slew Rate(Typ)(V/us): 13; Sub Family: General Purpose Amplifier, High Output Current Amplifier (>=50mA), High Supply Voltage Amplifier (>=30V), Precision Amplifier; Iq per channel(Max)(mA): 4; GBW(Typ)(MHz): 2.5; Code_JEDEC: MS-012; ComponentLink3URL: http://www.ti.com/litv/pdf/mpds092e; ComponentLink1Description: Manufacturer URL; PackageDescription: 8-Pin PowerPAD(TM) Plastic Small Outline, Body 3.9 x 4.9 mm, Pitch 1.27 mm; PackageVersion: 4202561/F, 12/2011; ComponentLink3Description: Package Specification; ComponentLink2URL: http://www.ti.com/lit/ds/symlink/opa454.pdf; ComponentLink2Description: Datasheet; IIB(Max)(pA): 100; ComponentLink1URL: http://www.ti.com/; DatasheetVersion: SBOS391A; Total Supply Voltage(Max)(+5V is 5, +/-5V is 10): 100; Eco-Plan: Green (RoHS & no Sb/Br); Mounting Technology: Surface Mount; Vio (25C)(Max)(mV): 4; PackageReference: DDA0008C; PartNumber: OPA454AIDDA